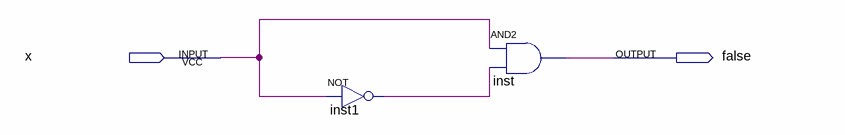
[diagram p0: schematic sheet]
// Quartus schematic make_false.bdf as structural Verilog: 2 symbols, 2 pins
module make_false (
  input  x,
  output false
);

  wire inst1_out;

  not inst1 (inst1_out, x);
  and inst (false, x, inst1_out);
endmodule
